# EAGLE design 5v_3v3_500ma (EAGLE 6.2)
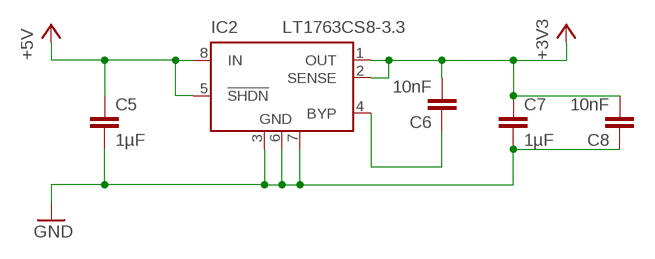
[diagram p0: schematic, sheet 1]

## Parts
C5  1µF  CAP0805  [0805]
C6  10nF  C-EUC0402  [C0402]
C7  1µF  CAP0805  [0805]
C8  10nF  C-EUC0402  [C0402]
IC2  LT1763CS8-3.3  [SOIC8]

## Nets
+3V3: C6.2 C7.1 C8.2 IC2.1(OUT) IC2.2(SENSE)
+5V: C5.1 IC2.5(!SHDN) IC2.8(IN)
GND: C5.2 C7.2 C8.1 IC2.3(GND) IC2.6(GND) IC2.7(GND)
N$13: C6.1 IC2.4(BYP)

## Library data of the parts
C5 C7 = SparkFun:CAP: Capacitor Standard 0603 ceramic capacitor, and 0.1" leaded capacitor.
C6 C8 = rcl:C-EU: CAPACITOR, European symbol
IC2 = linear-technology:LT1763CS8: 500mA, Low Noise, LDO Micropower Regulators Source: http://cds.linear.com/docs/Datasheet/1763ff.pdf

## Board
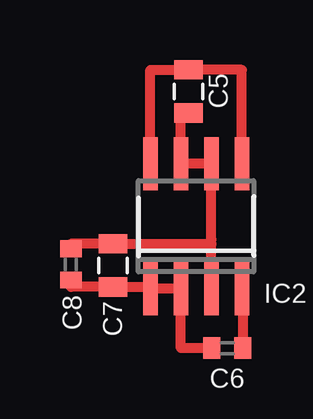
[diagram p1: board, top side]

No outline drawn. Coordinates in mm, seen from the top.
Copper layers (1*16): Top 0.035mm / dielectric 1.5mm / Bottom 0.035mm
Design rules: minimum track width 10mil, minimum drill 24mil, track to track 8mil, track to pad 8mil, pad to pad 8mil, via to via 8mil, smd to smd 8mil, copper to edge 40mil, drill to drill 8mil, minimum pad ring 10mil, minimum via ring 8mil, stop-mask expansion 4mil, vias tented up to drill 0mil, thermal gap 10mil

### Footprints (pad centres in the part's own frame; a part is rotated, then mirrored left to right if it is on the bottom)
0805 = smd 0.8 x 1.2: 1 -0.9,0; 2 0.9,0
C0402 = smd 0.7 x 0.9: 1 -0.65,0; 2 0.65,0
SOIC8 = smd 0.6 x 2.2: 1 -1.905,-2.6; 2 -0.635,-2.6; 3 0.635,-2.6; 4 1.905,-2.6; 5 1.905,2.6; 6 0.635,2.6; 7 -0.635,2.6; 8 -1.905,2.6

### Placement (x,y rotation side)
C5  14.92,11.97 270 top
C6  16.54,1.27 180 top
C7  11.78,4.72 90 top
C8  10.02,4.76 270 top
IC2  15.24,6.35 0 top

### Tracks (layer width: path | path; a pad name or v marks a point on that pad's centre or on a via)
+3V3
  Top 0.406: C6.2 14.61,1.27 IC2.2 IC2.1 13.34,3.82 C7.1 10.02,3.82 C8.2
+5V
  Top 0.406: IC2.8 13.34,12.87 C5.1 17.14,12.87 IC2.5
GND
  Top 0.406: C5.2 14.61,10.82 IC2.7 IC2.6 15.88,5.8 | IC2.3 15.88,5.8 | 15.88,5.8 15.88,5.62 C7.2 10.02,5.62 C8.1
N$13
  Top 0.406: IC2.4 17.19,3.71 C6.1